# Altium project Central Roll v1.1_Project.PrjPcb
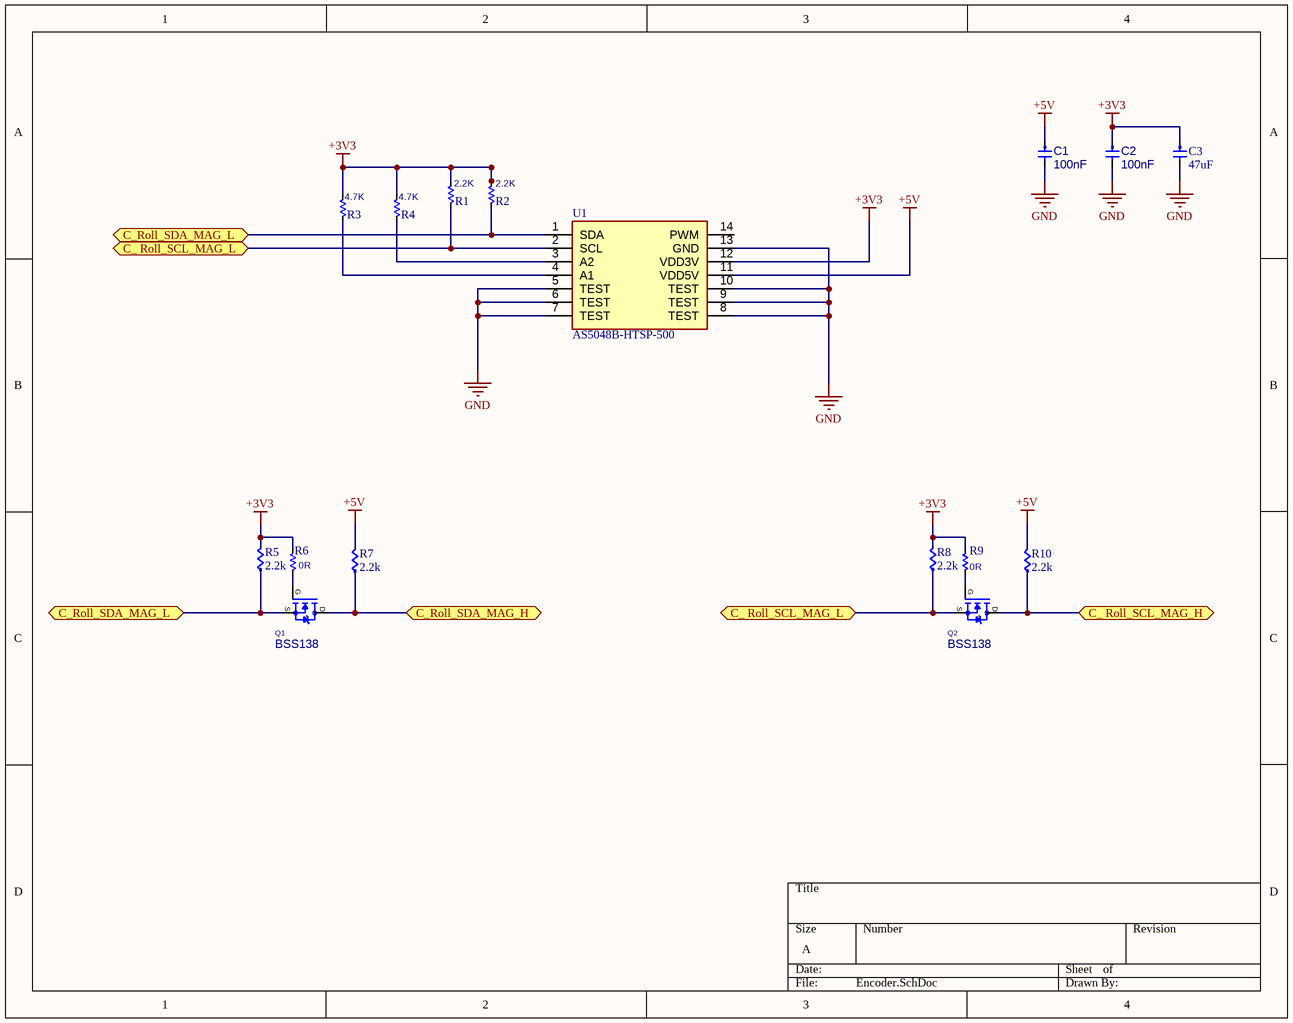
[diagram p0: Encoder.SchDoc]
5 sheets, 69 parts. Net scope: flat (ports and power ports of the same name join across sheets).
Board file: ROLL.PcbDoc
Sheets:
  Encoder.SchDoc
  Driver.SchDoc
  PWR.SchDoc
  Connector.SchDoc
  IMU.SchDoc

## Sheet Encoder.SchDoc
size A; SheetNumber: 1; SheetTotal: 5

### Parts
C1  Capacitance: 100nF  [CAP0603]  (hidden comment: C0603C104M5RACTU)
C2  Capacitance: 100nF  [CAP0603]  (hidden comment: C0603C104M5RACTU)
C3  Capacitance: 47uF  [CAP0805]  (hidden comment: CL21A476MQYNNNE)
Q1  BSS138  [BSS138]
Q2  BSS138  [BSS138]
R1  value 2.2K  [RES0603]  (hidden comment: RES0603)
R2  value 2.2K  [RES0603]  (hidden comment: RES0603)
R3  value 4.7K  [RES0603]  (hidden comment: RES0603)
R4  value 4.7K  [RES0603]  (hidden comment: RES0603)
R5  2.2k  [RES0603]
R6  value 0R  [RES0603]  (hidden comment: RES0603)
R7  2.2k  [RES0603]
R8  2.2k  [RES0603]
R9  value 0R  [RES0603]  (hidden comment: RES0603)
R10  2.2k  [RES0603]
U1  AS5048B-HTSP-500  [AS5048B-HTSP-500]

### Ports
C_ Roll_SCL_MAG_H (bidir), C_ Roll_SCL_MAG_L (bidir), C_Roll_SDA_MAG_H (bidir), C_Roll_SDA_MAG_L (bidir)

### Nets
+3V3: C2.1 C3.1 R1.1 R2.1 R3.1 R4.1 R5.2 R6.2 R8.2 R9.2 U1.12(VDD3V)
+5V: C1.1 R7.2 R10.2 U1.11(VDD5V)
GND: C1.2 C2.2 C3.2 U1.5(TEST) U1.6(TEST) U1.7(TEST) U1.8(TEST) U1.9(TEST) U1.10(TEST) U1.13(GND)
NetP1_49: Q1.3(D) R7.1 ; port C_Roll_SDA_MAG_H
NetP1_51: Q2.3(D) R10.1 ; port C_ Roll_SCL_MAG_H
NetQ1_1: Q1.1(G) R6.1
NetQ1_2: Q1.2(S) R2.2 R5.1 U1.1(SDA) ; port C_Roll_SDA_MAG_L
NetQ2_1: Q2.1(G) R9.1
NetQ2_2: Q2.2(S) R1.2 R8.1 U1.2(SCL) ; port C_ Roll_SCL_MAG_L
NetR3_2: R3.2 U1.4(A1)
NetR4_2: R4.2 U1.3(A2)

Not connected (* = marked no-connect by the designer): U1 14(PWM)

### Library data of the parts
C1 C2 = CMP-00691-1: CAP CER 0.1UF 50V X7R 0603; Manufacturer 1: KEMET; Tolerance: 20%; Dielectric Material: Ceramic; Dissipation Factor: 2.5%; Packaging: Tape and Reel; Mount: Surface Mount,PCB; Min Operating Temperature: -55°C; Case/Package: 0603; Max Operating Temperature: 125°C; Length: 1.6mm; Voltage Rating: 50V; Width: 0.031inch; Voltage Rating (DC): 50V; Dielectric: X7R; Thickness: 0.034inch; Case Code (Imperial): 0603; Case Code (Metric): 1608; Contact Plating: Tin,Matte; Depth: 0.8mm; Height: 0.8mm; Lead Pitch: 0.7mm; Manufacturer Part Number 1: C0603C104M5RACTU; Package Quantity: 1; Radiation Hardening: No; REACH SVHC: No SVHC; Termination: SMD/SMT
C3 = 885012107014: CAP CER 47UF 6.3V X5R 0805; Tolerance: 20%; Manufacturer Part Number: CL21A476MQYNNNE; RoHS: Yes; Category: Ceramic Capacitors; Stock 1: 3580; Pricing 1: 1=0.37000, 5=0.35200, 10=0.33000, 25=0.31900, 50=0.30900, 100=0.29800 (USD); Mount: Surface Mount; Case/Package: 0805; Case Code (Metric): 2012; Case Code (Imperial): 0805; Min Operating Temperature: -55°C; Max Operating Temperature: 85°C; Packaging: Cut Tape; Voltage Rating: 6.3V; Dielectric: X5R; Voltage Rating (DC): 6.3V; Series: WCAP-CSGP; Length: 0.079inch; Width: 0.049inch; Thickness: 0.057inch; RoHS Compliant: Yes; ComponentLink1URL: http://www.farnell.com/datasheets/1958454.pdf?src-supplier=Farnell; ComponentLink1Description: http://www.farnell.com/datasheets/1958454.pdf?src-supplier=Farnell; ComponentLink2URL: http://www.farnell.com/datasheets/1958454.pdf?src-supplier=Element14; ComponentLink2Description: http://www.farnell.com/datasheets/1958454.pdf?src-supplier=Element14; ComponentLink3URL: https://katalog.we-online.de/pbs/datasheet/885012107014.pdf?src-supplier=Digi-Key; ComponentLink3Description: https://katalog.we-online.de/pbs/datasheet/885012107014.pdf?src-supplier=Digi-Key; ComponentLink4URL: http://www.farnell.com/datasheets/1958454.pdf?src-supplier=Newark; ComponentLink4Description: http://www.farnell.com/datasheets/1958454.pdf?src-supplier=Newark; Supplier 1: Newark
Q1 Q2 = BSS138: N-Channel 50 V 220mA (Ta) 350mW (Ta) Surface Mount SOT-23-3; Drain to Source Voltage (Vdss): 50 V; (Max Rds On, Min Rds On: 4.5V, 10V; Rds On (Max) @ Id, Vgs: 3.5Ohm @ 220mA, 10V; Vgs(th) (Max) @ Id: 1.6V @ 1mA; Vgs (Max): ±20V; Input Capacitance (Ciss) (Max) @ Vds: 50 pF @ 25 V; Power Dissipation (Max): 225mW (Ta); MP: BSS138; FET Type: N-Channel; Current - Continuous Drain (Id) @ 25°C: 220mA; Operating Temperature: 150°C (TJ); Supplier Device Package: SOT-23
R1-R4 R6 R9 = RES0603: RES 0805; MP: add later
R5 R7 R8 R10 = RC0603FR-072K2L: Res Thick Film 0603 2.2K Ohm 1% 0.1W(1/10W) +/-100ppm/C Epoxy Pad SMD T/R; Manufacturer: Yageo Group; Max Power Dissipation: 100mW; Resistance: 2.2kΩ; Temperature Coefficient: 100ppm/°C; Voltage Rating: 75V; Voltage Rating (DC): 50V; Supplier 1: Avnet; Manufacturer Part Number: RC0603FR-072K2L; RoHS: Compliant; Category: Chip SMD Resistors; Stock 1: 415000; Pricing 1: 5000=0.00146, 10000=0.00141, 20000=0.00136, 30000=0.00131, 40000=0.00127 (USD); Case/Package: 0603; Case Code (Imperial): 0603; Case Code (Metric): 0603; China RoHS: Non-Compliant; Composition: Thick Film; Depth: 800µm; Features: Moisture Resistant; Height: 450µm; Lead Free: Lead Free; Length: 1.6mm; Lifecycle Status: Production; Max Operating Temperature: 155°C; Military Standard: Not; Min Operating Temperature: -55°C; Mount: Surface Mount; Number of Pins: 2; Number of Terminals: 2; Number of Terminations: 2; Packaging: Tape & Reel; Power Dissipation: 100mW; Power Rating: 100mW; REACH SVHC: Yes; Schedule B: 8533210045, 8533210045|8533210045|8533210045|8533210045|8533210045|8533210045|8533210045|8533210045|8533210045|8533210045|8533210045|8533210045|8533210045|8533210045|8533210045, 8533210045|8533210045|8533210045|8533210045|8533210045|8533210045|8533210045|8533210045|8533210045|8533210045|8533210045|8533210045|8533210045|8533210045|8533210045|8533210045, 8533210045|8533210045|8533210045|8533210045|8533210045|8533210045|8533210045|8533210045|8533210045|8533210045|8533210045|8533210045|8533210045|8533210045|8533210045|8533210045|8533210045; Termination: SMD/SMT; Tolerance: 1%; Width: 800µm; Working Voltage: 75V; ComponentLink1URL: https://datasheet.octopart.com:443/RC0603FR-072K2L-Yageo-datasheet-175887523.pdf?src-supplier=IHS; ComponentLink1Description: https://datasheet.octopart.com:443/RC0603FR-072K2L-Yageo-datasheet-175887523.pdf?src-supplier=IHS; ComponentLink2URL: https://datasheet.octopart.com:443/RC0603FR-072K2L-Yageo-datasheet-103092701.pdf?src-supplier=Upverter; ComponentLink2Description: https://datasheet.octopart.com:443/RC0603FR-072K2L-Yageo-datasheet-103092701.pdf?src-supplier=Upverter; ComponentLink3URL: https://datasheet.octopart.com:443/RC0603FR-072K2L-Yageo-datasheet-8328172.pdf?src-supplier=Newark; ComponentLink3Description: https://datasheet.octopart.com:443/RC0603FR-072K2L-Yageo-datasheet-8328172.pdf?src-supplier=Newark; ComponentLink4URL: https://datasheet.octopart.com:443/RC0603FR-072K2L-Yageo-datasheet-12596169.pdf?src-supplier=Newark; ComponentLink4Description: https://datasheet.octopart.com:443/RC0603FR-072K2L-Yageo-datasheet-12596169.pdf?src-supplier=Newark; ComponentLink5URL: https://datasheet.octopart.com:443/RC0603FR-072K2L-Yageo-datasheet-13691069.pdf?src-supplier=Newark; ComponentLink5Description: https://datasheet.octopart.com:443/RC0603FR-072K2L-Yageo-datasheet-13691069.pdf?src-supplier=Newark; ComponentLink6URL: https://datasheet.octopart.com:443/RC0603FR-072K2L-Yageo-datasheet-34211833.pdf?src-supplier=element14+APAC; ComponentLink6Description: https://datasheet.octopart.com:443/RC0603FR-072K2L-Yageo-datasheet-34211833.pdf?src-supplier=element14+APAC; ComponentLink7URL: https://datasheet.octopart.com:443/RC0603FR-072K2L-Yageo-datasheet-62067350.pdf?src-supplier=element14+APAC; ComponentLink7Description: https://datasheet.octopart.com:443/RC0603FR-072K2L-Yageo-datasheet-62067350.pdf?src-supplier=element14+APAC; ComponentLink8URL: https://datasheet.octopart.com:443/RC0603FR-072K2L-Yageo-datasheet-17842380.pdf?src-supplier=element14+APAC; ComponentLink8Description: https://datasheet.octopart.com:443/RC0603FR-072K2L-Yageo-datasheet-17842380.pdf?src-supplier=element14+APAC; ComponentLink9URL: https://datasheet.octopart.com:443/RC0603FR-072K2L-Yageo-datasheet-21426514.pdf?src-supplier=element14+APAC; ComponentLink9Description: https://datasheet.octopart.com:443/RC0603FR-072K2L-Yageo-datasheet-21426514.pdf?src-supplier=element14+APAC; ComponentLink10URL: https://datasheet.octopart.com:443/RC0603FR-072K2L-Yageo-datasheet-164759695.pdf?src-supplier=Future+Electronics; ComponentLink10Description: https://datasheet.octopart.com:443/RC0603FR-072K2L-Yageo-datasheet-164759695.pdf?src-supplier=Future+Electronics; ComponentLink11URL: https://datasheet.octopart.com:443/RC0603FR-072K2L-Yageo-datasheet-137700087.pdf?src-supplier=Future+Electronics; ComponentLink11Description: https://datasheet.octopart.com:443/RC0603FR-072K2L-Yageo-datasheet-137700087.pdf?src-supplier=Future+Electronics; ComponentLink12URL: https://datasheet.octopart.com:443/RC0603FR-072K2L-Yageo-datasheet-27584510.pdf?src-supplier=Future+Electronics; ComponentLink12Description: https://datasheet.octopart.com:443/RC0603FR-072K2L-Yageo-datasheet-27584510.pdf?src-supplier=Future+Electronics; ComponentLink13URL: https://datasheet.octopart.com:443/RC0603FR-072K2L-Yageo-datasheet-15599030.pdf?src-supplier=Future+Electronics; ComponentLink13Description: https://datasheet.octopart.com:443/RC0603FR-072K2L-Yageo-datasheet-15599030.pdf?src-supplier=Future+Electronics; ComponentLink14URL: https://datasheet.octopart.com:443/RC0603FR-072K2L-Yageo-datasheet-8324193.pdf?src-supplier=Future+Electronics; ComponentLink14Description: https://datasheet.octopart.com:443/RC0603FR-072K2L-Yageo-datasheet-8324193.pdf?src-supplier=Future+Electronics; ComponentLink15URL: https://datasheet.octopart.com:443/RC0603FR-072K2L-Yageo-datasheet-79472498.pdf?src-supplier=Megastar; ComponentLink15Description: https://datasheet.octopart.com:443/RC0603FR-072K2L-Yageo-datasheet-79472498.pdf?src-supplier=Megastar; ComponentLink16URL: https://datasheet.octopart.com/RC0603FR-072K2L-Yageo-datasheet-73766026.pdf; ComponentLink16Description: https://datasheet.octopart.com/RC0603FR-072K2L-Yageo-datasheet-73766026.pdf; ComponentLink17URL: https://datasheet.octopart.com:443/RC0603FR-072K2L-Yageo-datasheet-118562.pdf?src-supplier=DigiKey; ComponentLink17Description: https://datasheet.octopart.com:443/RC0603FR-072K2L-Yageo-datasheet-118562.pdf?src-supplier=DigiKey; ComponentLink18URL: https://datasheet.octopart.com:443/RC0603FR-072K2L-Yageo-datasheet-499455.pdf?src-supplier=element14; ComponentLink18Description: https://datasheet.octopart.com:443/RC0603FR-072K2L-Yageo-datasheet-499455.pdf?src-supplier=element14; ComponentLink19URL: http://sigma.octopart.com:80/rohs_statement/Yageo-company-2.pdf?src-supplier=Compliance+Statements; ComponentLink19Description: http://sigma.octopart.com:80/rohs_statement/Yageo-company-2.pdf?src-supplier=Compliance+Statements; ComponentLink20URL: http://sigma.octopart.com:80/conflict_mineral_statement/Yageo-company-3.pdf?src-supplier=Compliance+Statements; ComponentLink20Description: http://sigma.octopart.com:80/conflict_mineral_statement/Yageo-company-3.pdf?src-supplier=Compliance+Statements; Supplier Part Number 1: RC0603FR-072K2L
U1 = AS5048B-HTSP-500: Hall Effect Sensor Angle External Magnet, Not Included Gull Wing; Rotation Angle - Electrical, Mechanical: 0° ~ 360°, Continuous; Output: I2C, PWM; Voltage - Supply: 3V ~ 3.6V, 4.5V ~ 5.5V; MP: AS5048B-HTSP-500; Technology: Hall Effect; Actuator Type: External Magnet, Not Included; Mounting TypeOperating Temperature: -40°C ~ 150°C; Package / Case: 14-TSSOP

## Sheet Driver.SchDoc
size A; SheetNumber: 2; SheetTotal: 5
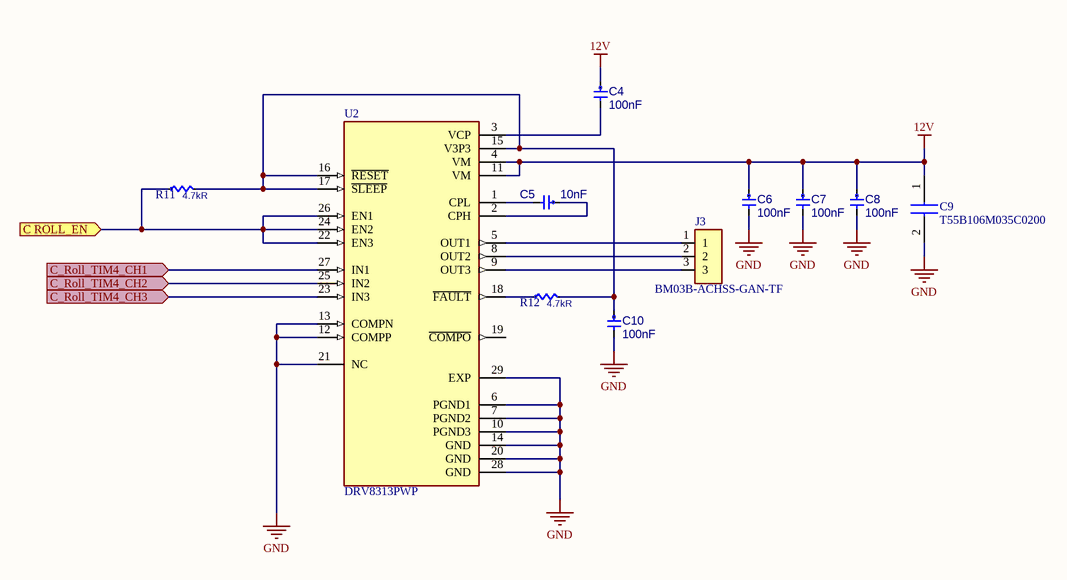
[diagram p1: Driver.SchDoc]

### Parts
C4  Capacitance: 100nF  [CAP0603]  (hidden comment: C0603C104M5RACTU)
C5  Capacitance: 10nF  [CAP0603]  (hidden comment: C0603C103M5RACTU)
C6  Capacitance: 100nF  [CAP0603]  (hidden comment: C0603C104M5RACTU)
C7  Capacitance: 100nF  [CAP0603]  (hidden comment: C0603C104M5RACTU)
C8  Capacitance: 100nF  [CAP0603]  (hidden comment: C0603C104M5RACTU)
C9  T55B106M035C0200  [T55B106M035C0200]
C10  Capacitance: 100nF  [CAP0603]  (hidden comment: C0603C104M5RACTU)
J3  BM03B-ACHSS-GAN-TF  [BM03B-ACHSS-GAN-TF]
R11  Resistance: 4.7kR  [RES0603]  (hidden comment: RC0603JR-074K7L)
R12  Resistance: 4.7kR  [RES0603]  (hidden comment: RC0603JR-074K7L)
U2  DRV8313PWP  [DRV8313PWP]

### Ports
C ROLL_EN (in), C_Roll_TIM4_CH1 (in), C_Roll_TIM4_CH2 (in), C_Roll_TIM4_CH3 (in)

### Nets
12V: C4.1 C6.1 C7.1 C8.1 C9.1 U2.4(VM) U2.11(VM)
GND: C6.2 C7.2 C8.2 C9.2 C10.2 U2.6(PGND1) U2.7(PGND2) U2.10(PGND3) U2.12(COMPP) U2.13(COMPN) U2.14(GND) U2.20(GND) U2.21(NC) U2.28(GND) U2.29(EXP)
NetC4_2: C4.2 U2.3(VCP)
NetC5_1: C5.1 U2.2(CPH)
NetC5_2: C5.2 U2.1(CPL)
NetC10_1: C10.1 R11.2 R12.2 U2.15(V3P3) U2.16(~{RESET}) U2.17(~{SLEEP})
NetJ3_1: J3.1 U2.5(OUT1)
NetJ3_2: J3.2 U2.8(OUT2)
NetJ3_3: J3.3 U2.9(OUT3)
NetP1_20: R11.1 U2.22(EN3) U2.24(EN2) U2.26(EN1) ; port C ROLL_EN
NetP1_24: U2.27(IN1) ; port C_Roll_TIM4_CH1
NetP1_26: U2.25(IN2) ; port C_Roll_TIM4_CH2
NetP1_28: U2.23(IN3) ; port C_Roll_TIM4_CH3
NetR12_1: R12.1 U2.18(~{FAULT})

Not connected (* = marked no-connect by the designer): U2 19(~{COMPO})

### Library data of the parts
C4 C6-C8 C10 = CMP-00691-1: as C1 on sheet Encoder; Packaging: Tape and Reel; Mount: Surface Mount,PCB; Min Operating Temperature: -55°C; Case/Package: 0603; Max Operating Temperature: 125°C; Length: 1.6mm; Voltage Rating: 50V; Width: 0.031inch; Voltage Rating (DC): 50V; Dielectric: X7R; Thickness: 0.034inch; Case Code (Imperial): 0603; Case Code (Metric): 1608; Contact Plating: Tin,Matte; Depth: 0.8mm; Height: 0.8mm; Lead Pitch: 0.7mm; Manufacturer Part Number 1: C0603C104M5RACTU; Package Quantity: 1; Radiation Hardening: No; REACH SVHC: No SVHC; Termination: SMD/SMT
C5 = CMP-00691-1: CAP CER 10NF 50V X7R 0603; Manufacturer 1: KEMET; Tolerance: 20%; Dielectric Material: Ceramic; Dissipation Factor: 2.5%; Packaging: Tape and Reel; Mount: Surface Mount,PCB; Min Operating Temperature: -55°C; Case/Package: 0603; Max Operating Temperature: 125°C; Length: 1.6mm; Voltage Rating: 50V; Width: 0.031inch; Voltage Rating (DC): 50V; Dielectric: X7R; Thickness: 0.034inch; Case Code (Imperial): 0603; Case Code (Metric): 1608; Contact Plating: Tin,Matte; Depth: 0.8mm; Height: 0.8mm; Lead Pitch: 0.7mm; Manufacturer Part Number 1: C0603C103M5RACTU; Package Quantity: 1; Radiation Hardening: No; REACH SVHC: No SVHC; Termination: SMD/SMT
C9 = T55B106M035C0200: Capacitor; Manufacturer_Name: Vishay; Datasheet Link: https://www.mouser.cn/datasheet/2/427/t55-537218.pdf; Height: 2.1mm; Manufacturer_Part_Number: T55B106M035C0200; Mouser Part Number: 74-T55B106M035C0200; Mouser Price/Stock: https://www.mouser.co.uk/ProductDetail/Vishay-Polytech/T55B106M035C0200?qs=BZBei1rCqCCB8UyqeipbyQ%3D%3D; Arrow Part Number: T55B106M035C0200; Arrow Price/Stock: https://www.arrow.com/en/products/t55b106m035c0200/vishay
J3 = BM03B-ACHSS-GAN-TF: ACH Series 3 Position 1.2 mm Pitch Disconnectable Crimp Style Housing; Package: None; Price: None; Value: *; MP: BM03B-ACHSS-GAN-TF; Availability: Unavailable
R11 R12 = CMP-01404-1: RES SMD 4.7K OHM 5% 1/10W 0603; Manufacturer 1: Yageo; Voltage Rating (DC): 50V; Temperature Coefficient: 100ppm/°C; Max Power Dissipation: 100mW; Number of Terminations: 2; Width: 0.8mm; Min Operating Temperature: -55°C; Case/Package: 0603; Military Standard: Not; Termination: SMD/SMT; Manufacturer Part Number 1: RC0603JR-074K7L; Construction: Rectangular; Features: Moisture Resistant; Length: 1.6mm; Resistance Tolerance: 5%; Lead Free: Lead Free; REACH SVHC: No SVHC; Voltage Rating: 50V; Case Code (Metric): 1608; Case Code (Imperial): 0603; Packaging: Tape and Reel; Max Operating Temperature: 155°C; Size Code: 0603; Resistor Type: Thick Film; Tolerance: 5%; Number of Pins: 2; Depth: 0.8mm; Power Rating: 100mW; Series: RC
U2 = DRV8313PWP: 65-V max, 3-A peak 3-phase motor driver; MF: Texas Instruments; Package: HTSSOP-28 Texas Instruments; Price: None; Check_prices: https://www.snapeda.com/parts/DRV8313PWP/Texas+Instruments/view-part/?ref=eda; Value: *; SnapEDA_Link: https://www.snapeda.com/parts/DRV8313PWP/Texas+Instruments/view-part/?ref=snap; MP: DRV8313PWP; Availability: In Stock; Purchase-URL: https://pricing.snapeda.com/search?q=DRV8313PWP&ref=eda

## Sheet PWR.SchDoc
size A; SheetNumber: 3; SheetTotal: 5
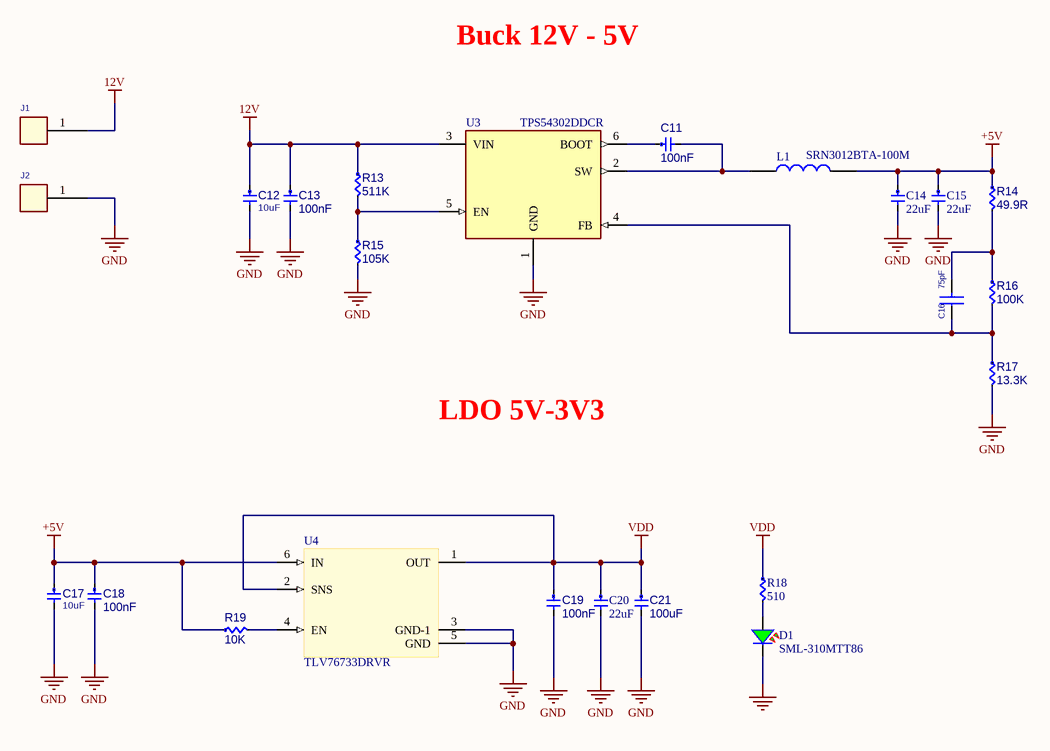
[diagram p2: PWR.SchDoc]

### Parts
C11  Capacitance: 100nF  [CAP0402]  (hidden comment: CC0402KRX5R9BB104)
C12  Capacitance: 10uF  [CAP0603]  (hidden comment: GRM188R6YA106MA73D)
C13  Capacitance: 100nF  [CAP0402]  (hidden comment: CC0402KRX5R9BB104)
C14  Capacitance: 22uF  [CAP0402]  (hidden comment: GRM158R61A226ME15D)
C15  Capacitance: 22uF  [CAP0402]  (hidden comment: GRM158R61A226ME15D)
C16  75pF  [CAP0402]
C17  Capacitance: 10uF  [CAP0603]  (hidden comment: GRM188R6YA106MA73D)
C18  Capacitance: 100nF  [CAP0402]  (hidden comment: CC0402KRX5R9BB104)
C19  Capacitance: 100nF  [CAP0402]  (hidden comment: CC0402KRX5R9BB104)
C20  Capacitance: 22uF  [CAP0402]  (hidden comment: GRM158R61A226ME15D)
C21  Capacitance: 100uF  [CAP0805]  (hidden comment: CL21A107MQYNNWE)
D1  SML-310MTT86  [LED0603 RED]
J1  CON1  [ESC PAD 3X4]  (value not drawn)
J2  CON1  [ESC PAD 3X4]  (value not drawn)
L1  SRN3012BTA-100M  [SRN3012BTA-100M]
R13  511K  [RES0402]
R14  49.9R  [RES0402]
R15  105K  [RES0402]
R16  100K  [RES0402]
R17  13.3K  [RES0402]
R18  Resistance: 510  [RES0402]  (hidden comment: RT0402FRE07510RL)
R19  Resistance: 10K  [RES0402]  (hidden comment: CRCW040210K0JNED)
U3  TPS54302DDCR  [SOT95P280X110-6N - duplicate]
U4  TLV76733DRVR  [SON65P200X200X80-7N - duplicate]

### Nets
12V: C12.1 C13.1 J1.1 R13.1 U3.3(VIN)
+5V: C14.1 C15.1 C17.1 C18.1 L1.2 R14.1 R19.1 U4.6(IN)
GND: C12.2 C13.2 C14.2 C15.2 C17.2 C18.2 C19.2 C20.2 C21.2 D1.1 J2.1 R15.2 R17.2 U3.1(GND) U4.3(GND-1) U4.5(GND)
VDD: C19.1 C20.1 C21.1 R18.1 U4.1(OUT) U4.2(SNS)
NetC11_1: C11.1 U3.6(BOOT)
NetC11_2: C11.2 L1.1 U3.2(SW)
NetC16_1: C16.1 R16.2 R17.1 U3.4(FB)
NetC16_2: C16.2 R14.2 R16.1
NetD1_2: D1.2 R18.2
NetR13_2: R13.2 R15.1 U3.5(EN)
NetR19_2: R19.2 U4.4(EN)

### Notes on the sheet
- Buck 12V - 5V
- LDO 5V-3V3

### Library data of the parts
C11 C13 C18 C19 = CMP-00265-1: CAP CER 0.1UF 50V X5R 0402; Manufacturer: Yageo; Tolerance: 10%; Voltage Rating: 50V; Dielectric: X5R; Width: 0.02inch; Thickness: 0.022inch; Packaging: Tape and Reel; Length: 0.039inch; Mount: Surface Mount; Case/Package: 0402; Min Operating Temperature: -55°C; Halogen Free: Halogen Free; Voltage Rating (DC): 50V; Manufacturer Part Number: CC0402KRX5R9BB104; Max Operating Temperature: 85°C; Lead Free: Lead Free; Manufacturer 1: Yageo; Manufacturer Part Number 1: CC0402KRX5R9BB104
C12 C17 = CMP-01031-1: CAP CER 10UF 35V X5R 0603; Manufacturer 1: Murata Electronics; Tolerance: 20%; Case/Package: 0603; Depth: 0.8mm; Composition: Ceramic; Length: 1.6mm; Max Operating Temperature: 85°C; Lead Free: Lead Free; Thickness: 0.031inch; Number of Pins: 2; Weight: 0.000222oz; Min Operating Temperature: -55°C; REACH SVHC: No SVHC; Case Code (Metric): 1608; Termination: SMD/SMT; Packaging: Tape and Reel; Height: 0.8mm; Voltage Rating (DC): 35V; Width: 0.031inch; Voltage Rating: 35V; Manufacturer Part Number 1: GRM188R6YA106MA73D; Mount: Surface Mount; Package Quantity: 1; Case Code (Imperial): 0603; Dielectric: X5R; Voltage: 35V
C14 C15 C20 = CMP-00520-1: CAP CER 22UF 10V X5R 0402; Manufacturer 1: TDK Corporation; Tolerance: 10%; Case Code (Imperial): 0402; Case/Package: 0402; Voltage: 10V; Min Operating Temperature: -55°C; Termination: SMD/SMT; Voltage Rating: 10V; Length: 1mm; REACH SVHC: No SVHC; Max Operating Temperature: 85°C; Radiation Hardening: No; Depth: 0.5mm; Case Code (Metric): 1005; Dielectric: X5R; Manufacturer Part Number 1: GRM158R61A226ME15D; Packaging: Tape and Reel
C16 = CAP_Dup1_16: CAP CER 75PF 25V C0G/NP0 0402; Manufacturer PN: CC0402JRNPO9BN750; Manufacturer: YAGEO; PART_NUMBER: TMP-416; CLASS: DISCRETE; Tolerance: 5%; Temperature Coefficient: C0G, NP0; Dielectric Type: Capacitors; Rated Voltage: 25V; Package Size: 0402 (1005 Metric)
C21 = CMP-00446-1: CAP CER 100UF 6.3V X5R 0805; Manufacturer 1: TDK Corporation; Tolerance: 20%; Dielectric Material: Ceramic; Length: 2mm; Dielectric: X5R; Height: 1.25mm; Width: 0.049inch; Depth: 1.25mm; Voltage Rating (DC): 6.3V; Manufacturer Part Number 1: CL21A107MQYNNWE; REACH SVHC: No SVHC; Weight: 0.000194oz; Package Quantity: 2000; Mount: Surface Mount; Packaging: Tape and Reel; Case Code (Imperial): 0805; Thickness: 0.057inch; Max Operating Temperature: 85°C; Case/Package: 0805; Case Code (Metric): 2012; Voltage Rating: 6.3V; Termination: SMD/SMT; Composition: Ceramic; Lead Free: Lead Free; Min Operating Temperature: -55°C
D1 = CMP-01130-2: LED GREEN CLEAR 0603 SMD; Manufacturer 1: Rohm Semiconductor; Luminous Intensity: 16mcd; Wavelength: 570nm; Number of LEDs: 1; Color: Green,Yellow; Forward Voltage: 2.2V; Lens Color: Colorless,Clear; Forward Current: 20mA; Viewing Angle: 140°; Lens Style: Rectangular,Clear,Diffused,Colorless; Case Code (Imperial): 0603; Lens Transparency: Clear; Package Quantity: 3000; Width: 0.8mm; Manufacturer Part Number 1: SML-310MTT86; Min Operating Temperature: -30°C; Length: 1.6mm; Packaging: Tape and Reel; Dominant Wavelength: 570nm; Height: 0.9mm; Radiation Hardening: No; Test Current: 20mA; Case Code (Metric): 1608; Lead Free: Lead Free; Case/Package: 0603; Mount: Surface Mount; Max Operating Temperature: 85°C; Illumination Color: Green; Number of Pins: 2
J1 J2 = CON1: SOLDER PADS
L1 = SRN3012BTA-330M: 10uH; Manufacturer_Name: Bourns; Geometry.Height: 1.2mm; Mouser Part Number: SRN3012BTA-100M; Mouser Price/Stock: https://www.mouser.co.uk/ProductDetail/Bourns/SRN3012BTA-330M?qs=Imq1NPwxi74rPoSZ4PPaRw%3D%3D; Manufacturer_Part_Number: SRN3012BTA-100M; Datasheet Link: https://www.bourns.com/docs/Product-Datasheets/SRN3012BTA.pdf
R13 = CMP-00299-1_1: RES SMD 511K OHM 1% 1/16W 0402; Manufacturer: Yageo; Manufacturer Part Number: RC0402FR-07511KL; Temperature Coefficient: 100ppm/°C; Working Voltage: 50V; Max Power Dissipation: 63mW; Power Rating: 62.5mW; Height: 0.016inch; Package Quantity: 1; Min Operating Temperature: -55°C; Tolerance: 1%; Military Standard: Not; Packaging: Tape and Reel; Number of Terminations: 2; Width: 0.02inch; Case/Package: 0402; Length: 1mm; Voltage Rating (DC): 50V; Case Code (Metric): 1005; Resistance: 511K; Composition: Thick Film; Voltage Rating: 50V; Max Operating Temperature: 155°C; Case Code (Imperial): 0402; Lead Free: Lead Free; Termination: SMD/SMT; Features: Moisture Resistant; Depth: 0.5mm; Manufacturer 1: Yageo; Manufacturer Part Number 1: RC0402FR-07511KL
R14 = CMP-00299-1_1: RES SMD 49.9R OHM 1% 1/16W 0402; Manufacturer: Yageo; Manufacturer Part Number: RC0402FR-0749R9L; Temperature Coefficient: 100ppm/°C; Working Voltage: 50V; Max Power Dissipation: 63mW; Power Rating: 62.5mW; Height: 0.016inch; Package Quantity: 1; Min Operating Temperature: -55°C; Tolerance: 1%; Military Standard: Not; Packaging: Tape and Reel; Number of Terminations: 2; Width: 0.02inch; Case/Package: 0402; Length: 1mm; Voltage Rating (DC): 50V; Case Code (Metric): 1005; Resistance: 49.9R; Composition: Thick Film; Voltage Rating: 50V; Max Operating Temperature: 155°C; Case Code (Imperial): 0402; Lead Free: Lead Free; Termination: SMD/SMT; Features: Moisture Resistant; Depth: 0.5mm; Manufacturer 1: Yageo; Manufacturer Part Number 1: RC0402FR-0749R9L
R15 = CMP-00299-1_1: RES SMD 105K OHM 1% 1/16W 0402; Manufacturer: Yageo; Manufacturer Part Number: RC0402FR-07105KL; Temperature Coefficient: 100ppm/°C; Working Voltage: 50V; Max Power Dissipation: 63mW; Power Rating: 62.5mW; Height: 0.016inch; Package Quantity: 1; Min Operating Temperature: -55°C; Tolerance: 1%; Military Standard: Not; Packaging: Tape and Reel; Number of Terminations: 2; Width: 0.02inch; Case/Package: 0402; Length: 1mm; Voltage Rating (DC): 50V; Case Code (Metric): 1005; Resistance: 105K; Composition: Thick Film; Voltage Rating: 50V; Max Operating Temperature: 155°C; Case Code (Imperial): 0402; Lead Free: Lead Free; Termination: SMD/SMT; Features: Moisture Resistant; Depth: 0.5mm; Manufacturer 1: Yageo; Manufacturer Part Number 1: RC0402FR-07105KL
R16 = CMP-00299-1_1: RES SMD 100K OHM 1% 1/16W 0402; Manufacturer: Yageo; Manufacturer Part Number: RC0402FR-07100KL; Temperature Coefficient: 100ppm/°C; Working Voltage: 50V; Max Power Dissipation: 63mW; Power Rating: 62.5mW; Height: 0.016inch; Package Quantity: 1; Min Operating Temperature: -55°C; Tolerance: 1%; Military Standard: Not; Packaging: Tape and Reel; Number of Terminations: 2; Width: 0.02inch; Case/Package: 0402; Length: 1mm; Voltage Rating (DC): 50V; Case Code (Metric): 1005; Resistance: 100K; Composition: Thick Film; Voltage Rating: 50V; Max Operating Temperature: 155°C; Case Code (Imperial): 0402; Lead Free: Lead Free; Termination: SMD/SMT; Features: Moisture Resistant; Depth: 0.5mm; Manufacturer 1: Yageo; Manufacturer Part Number 1: RC0402FR-07100KL
R17 = CMP-00299-1_1: RES SMD 13.3K OHM 1% 1/16W 0402; Manufacturer: Yageo; Manufacturer Part Number: RC0402FR-0713K3L; Temperature Coefficient: 100ppm/°C; Working Voltage: 50V; Max Power Dissipation: 63mW; Power Rating: 62.5mW; Height: 0.016inch; Package Quantity: 1; Min Operating Temperature: -55°C; Tolerance: 1%; Military Standard: Not; Packaging: Tape and Reel; Number of Terminations: 2; Width: 0.02inch; Case/Package: 0402; Length: 1mm; Voltage Rating (DC): 50V; Case Code (Metric): 1005; Resistance: 13.3K; Composition: Thick Film; Voltage Rating: 50V; Max Operating Temperature: 155°C; Case Code (Imperial): 0402; Lead Free: Lead Free; Termination: SMD/SMT; Features: Moisture Resistant; Depth: 0.5mm; Manufacturer 1: Yageo; Manufacturer Part Number 1: RC0402FR-0713K3L
R18 = RC0402FR-0722KL: RES SMD 510 OHM 1% 1/16W 0402; Manufacturer: Yageo; Power Rating: 62.5mW; Temperature Coefficient: 100ppm/°C; Voltage Rating: 50V; Max Power Dissipation: 63mW; Supplier 1: Future Electronics; Manufacturer Part Number: RT0402FRE07510RL; RoHS: Yes; Category: Chip SMD Resistors; Stock 1: 1010000; Pricing 1: 10000=0.00100, 50000=0.00090, 300000=0.00080, 1000000=0.00080, 3000000=0.00070 (USD); Case/Package: 0402; Case Code (Metric): 1005; Case Code (Imperial): 0402; Min Operating Temperature: -55°C; Max Operating Temperature: 155°C; Tolerance: 1%; Packaging: Tape and Reel; Package Quantity: 1; Resistor Type: Thick Film; Number of Terminations: 2; Termination: SMD/SMT; Working Voltage: 50V; Features: Moisture Resistant; Series: RC; Resistance Tolerance: 1%; Construction: Rectangular; Length: 0.039inch; Width: 0.02inch; Height: 0.016inch; Depth: 0.5mm; Reach SVHC Compliant: Yes; Lead Free: Lead Free; Military Standard: Not; RoHS Compliant: Yes
R19 = CMP-00034-1: RES SMD 10K OHM 5% 1/16W 0402; Manufacturer: Vishay Dale; Voltage Rating: 50V; Power Rating: 63mW; Temperature Coefficient: 200ppm/°C; Max Operating Temperature: 155°C; Width: 0.5mm; Composition: Thick Film; Length: 1mm; Case Code (Imperial): 0402; Case/Package: 0402; Number of Terminations: 2; Mount: Surface Mount; Depth: 0.5mm; Weight: 2.3E-05oz; Radiation Hardening: No; Package Quantity: 1; Case Code (Metric): 1005; REACH SVHC: Unknown; Tolerance: 5%; Features: Automotive AEC-Q200; Max Power Dissipation: 63mW; Height: 0.016inch; Packaging: Tape and Reel; Military Standard: Not; Min Operating Temperature: -55°C; Manufacturer Part Number 1: CRCW040210K0JNED; Contact Plating: Tin; Termination: SMD/SMT
U3 = TPS54302DDCR: 4.5-V to 28-V Input, 3-A Output, EMI Friendly Synchronous Step-Down Converter; MF: Texas Instruments; Package: SOT-23-THN-6 Texas Instruments; Price: None; Check_prices: https://www.snapeda.com/parts/TPS54302DDCR/Texas+Instruments/view-part/?ref=eda; Value: *; SnapEDA_Link: https://www.snapeda.com/parts/TPS54302DDCR/Texas+Instruments/view-part/?ref=snap; MP: TPS54302DDCR; Availability: In Stock; Purchase-URL: https://pricing.snapeda.com/search?q=TPS54302DDCR&ref=eda
U4 = TLV76733DRVR: Adjustable- and fixed-output, 1-A, 16-V, positive-voltage low-dropout (LDO) linear regulator; MF: Texas Instruments; SnapEDA_Link: https://www.snapeda.com/parts/TLV76733DRVR/Texas+Instruments/view-part/?ref=snap; Package: WSON-6 Texas Instruments; Value: *; MP: TLV76733DRVR; Check_prices: https://www.snapeda.com/parts/TLV76733DRVR/Texas+Instruments/view-part/?ref=eda

## Sheet Connector.SchDoc
size A2; SheetNumber: 4; SheetTotal: 5
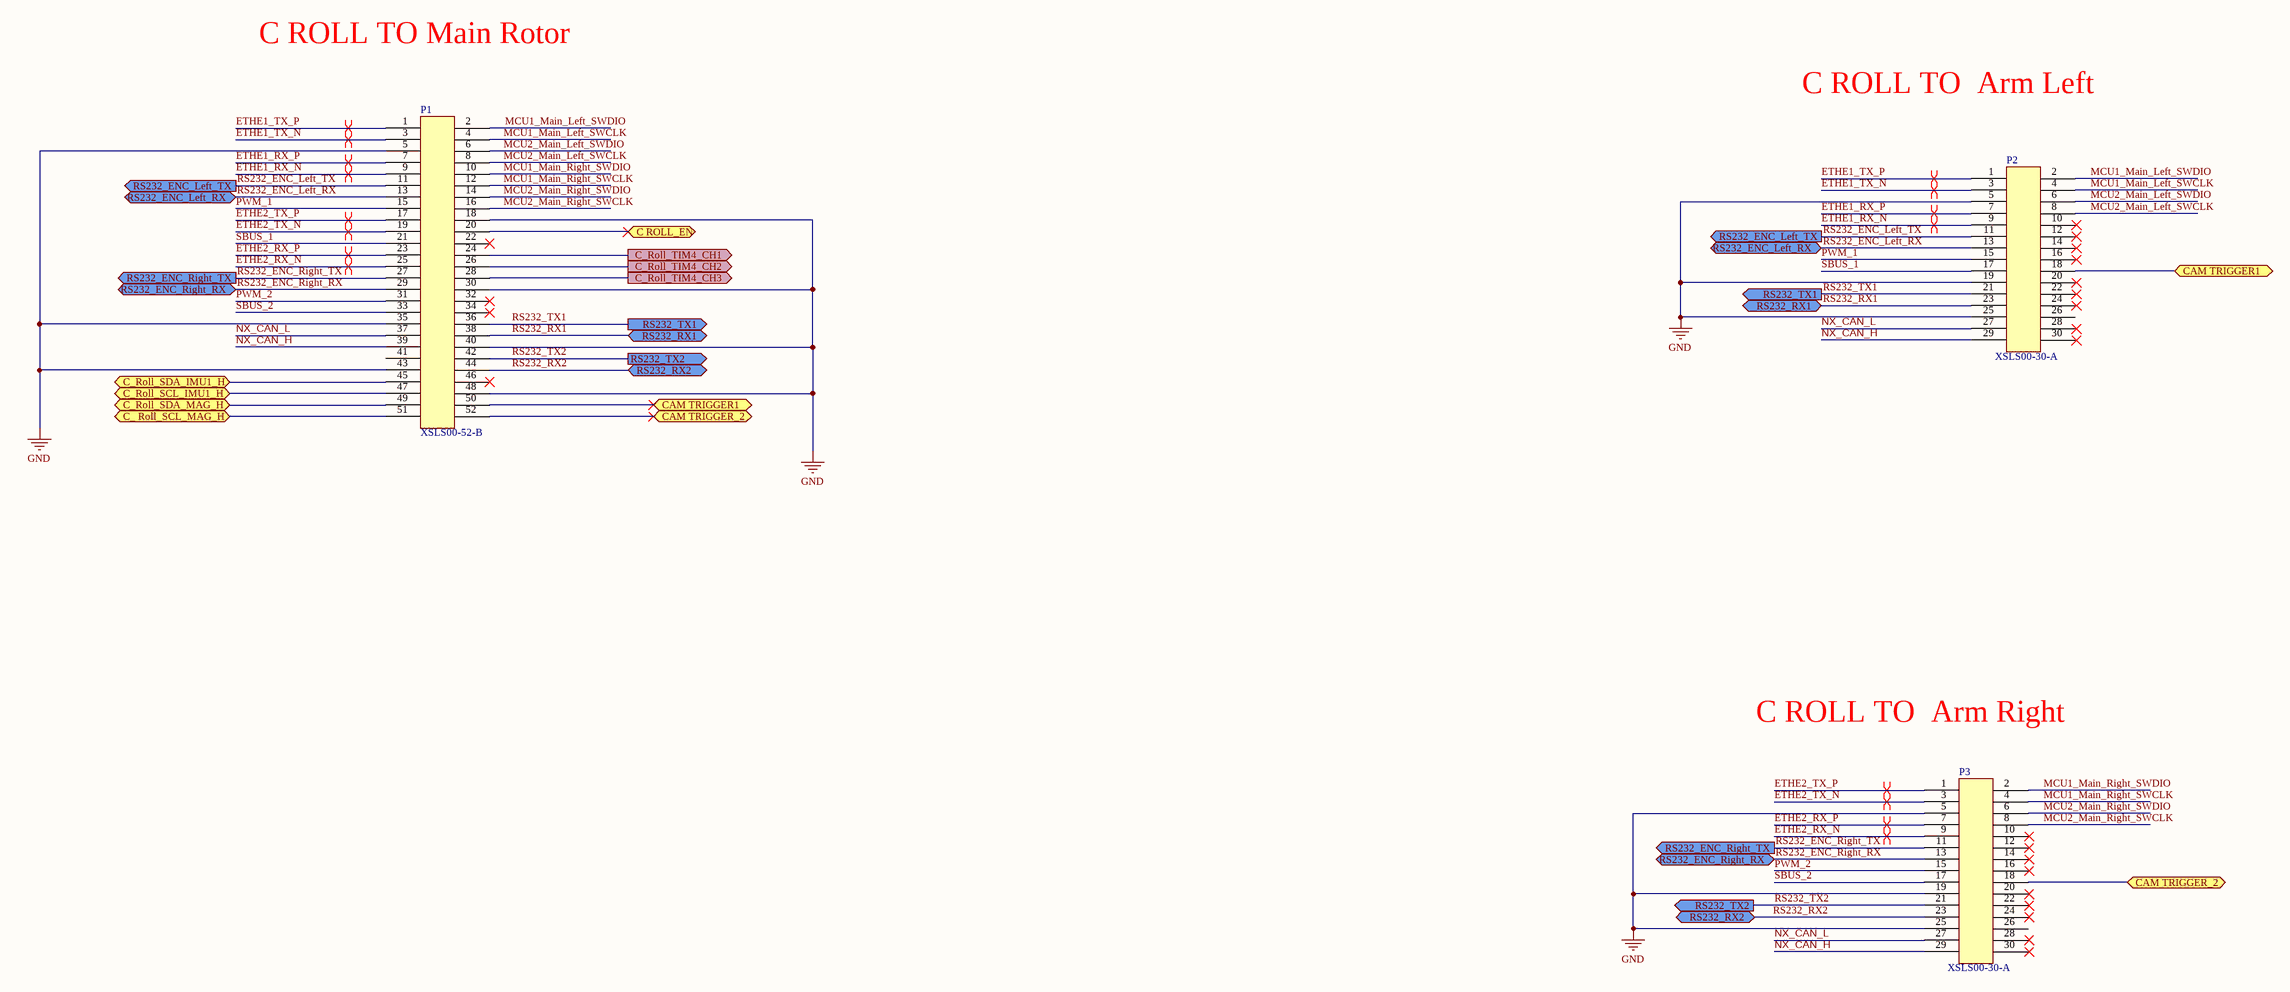
[diagram p3: Connector.SchDoc]

### Parts
P1  XSLS00-52-B  [XSXL52]
P2  XSLS00-30-A  [XSXL30]
P3  XSLS00-30-A  [XSXL30]

### Ports
C ROLL_EN (bidir), C_ Roll_SCL_MAG_H (bidir), C_Roll_SCL_IMU1_H (bidir), C_Roll_SDA_IMU1_H (bidir), C_Roll_SDA_MAG_H (bidir), C_Roll_TIM4_CH1 (out), C_Roll_TIM4_CH2 (out), C_Roll_TIM4_CH3 (out), CAM TRIGGER1 (bidir), CAM TRIGGER_2 (bidir), RS232_ENC_Left_RX (bidir), RS232_ENC_Left_TX (out), RS232_ENC_Right_RX (bidir), RS232_ENC_Right_TX (out), RS232_RX1 (bidir), RS232_RX2 (bidir), RS232_TX1 (out), RS232_TX2 (out)

### Nets
GND: P1.5 P1.18 P1.30 P1.35 P1.40 P1.43 P1.48 P2.5 P2.19 P2.25 P3.5 P3.19 P3.25
ETHE1_RX_N: P1.9 P2.9
ETHE1_RX_P: P1.7 P2.7
ETHE1_TX_N: P1.3 P2.3
ETHE1_TX_P: P1.1 P2.1
ETHE2_RX_N: P1.25 P3.9
ETHE2_RX_P: P1.23 P3.7
ETHE2_TX_N: P1.19 P3.3
ETHE2_TX_P: P1.17 P3.1
MCU1_Main_Left_SWCLK: P1.4 P2.4
MCU1_Main_Left_SWDIO: P1.2 P2.2
MCU1_Main_Right_SWCLK: P1.12 P3.4
MCU1_Main_Right_SWDIO: P1.10 P3.2
MCU2_Main_Left_SWCLK: P1.8 P2.8
MCU2_Main_Left_SWDIO: P1.6 P2.6
MCU2_Main_Right_SWCLK: P1.16 P3.8
MCU2_Main_Right_SWDIO: P1.14 P3.6
NX_CAN_H: P1.39 P2.29 P3.29
NX_CAN_L: P1.37 P2.27 P3.27
PWM_1: P1.15 P2.15
PWM_2: P1.31 P3.15
RS232_ENC_Left_RX: P1.13 P2.13 ; port RS232_ENC_Left_RX
RS232_ENC_Left_TX: P1.11 P2.11 ; port RS232_ENC_Left_TX
RS232_ENC_Right_RX: P1.29 P3.13 ; port RS232_ENC_Right_RX
RS232_ENC_Right_TX: P1.27 P3.11 ; port RS232_ENC_Right_TX
RS232_RX1: P1.38 P2.23 ; port RS232_RX1
RS232_RX2: P1.44 P3.23 ; port RS232_RX2
RS232_TX1: P1.36 P2.21 ; port RS232_TX1
RS232_TX2: P1.42 P3.21 ; port RS232_TX2
SBUS_1: P1.21 P2.17
SBUS_2: P1.33 P3.17
NetP1_20: P1.20 ; port C ROLL_EN
NetP1_24: P1.24 ; port C_Roll_TIM4_CH1
NetP1_26: P1.26 ; port C_Roll_TIM4_CH2
NetP1_28: P1.28 ; port C_Roll_TIM4_CH3
NetP1_45: P1.45 ; port C_Roll_SDA_IMU1_H
NetP1_47: P1.47 ; port C_Roll_SCL_IMU1_H
NetP1_49: P1.49 ; port C_Roll_SDA_MAG_H
NetP1_50: P1.50 P2.18 ; port CAM TRIGGER1
NetP1_51: P1.51 ; port C_ Roll_SCL_MAG_H
NetP1_52: P1.52 P3.18 ; port CAM TRIGGER_2

Not connected (* = marked no-connect by the designer): P1 22* 32* 34* 41 46*; P2 10 12 14 16 20 22 24 26 28 30; P3 10 12 14 16 20 22 24 26 28 30

### Layout directives
differential pair: ETHE1_RX_N, ETHE1_RX_P, ETHE1_TX_N, ETHE1_TX_P, ETHE2_RX_N, ETHE2_RX_P, ETHE2_TX_N, ETHE2_TX_P

### Notes on the sheet
- C ROLL TO Main Rotor
- C ROLL TO  Arm Left
- C ROLL TO  Arm Right

## Sheet IMU.SchDoc
size A; SheetNumber: 5; SheetTotal: 5
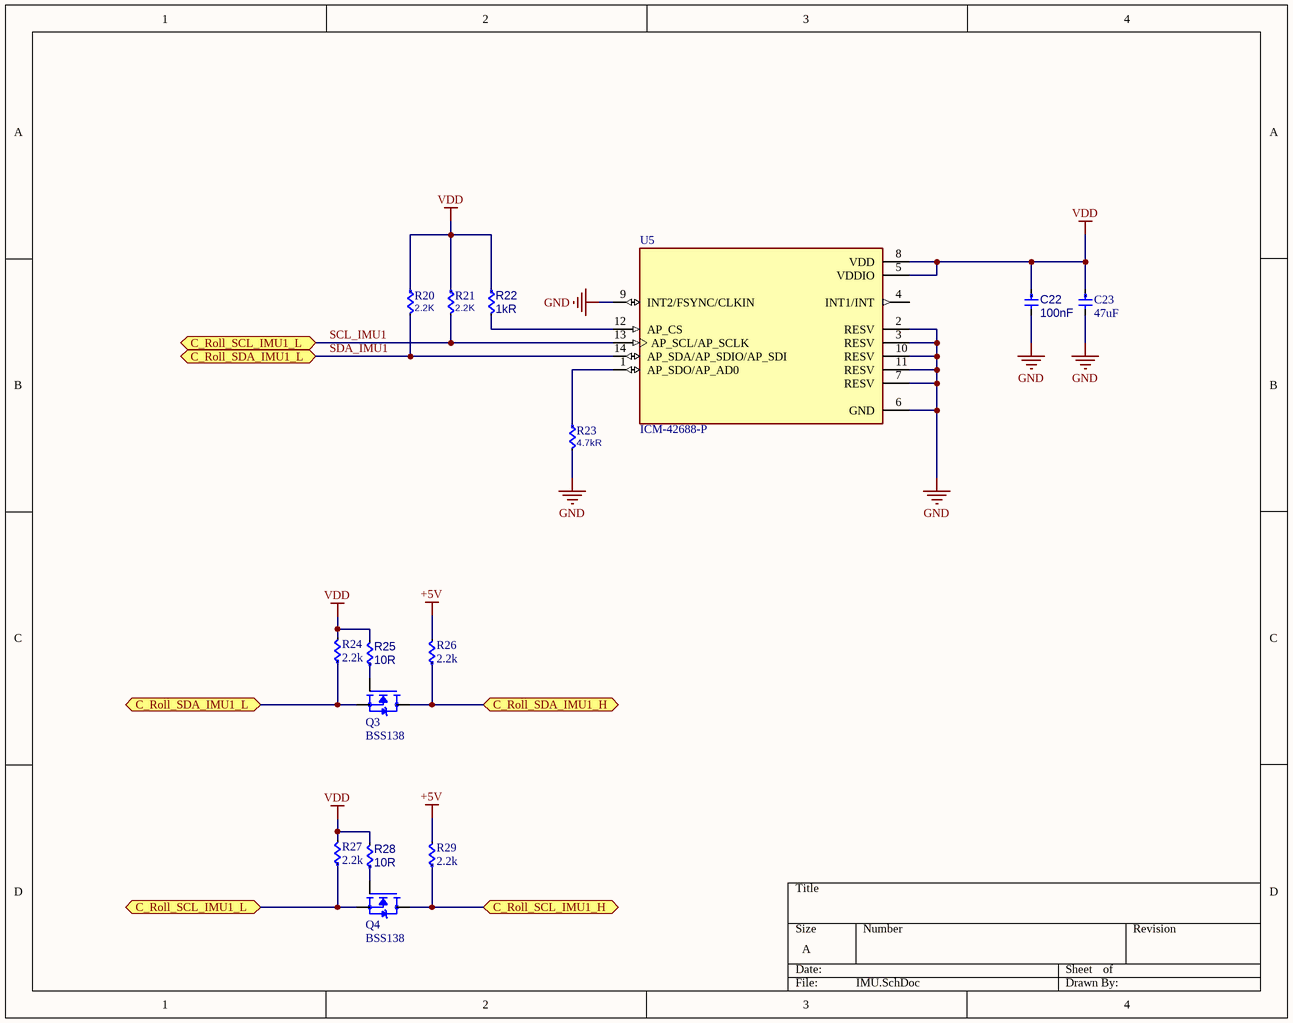
[diagram p4: IMU.SchDoc]

### Parts
C22  Capacitance: 100nF  [CAP0603]  (hidden comment: C0603C104M5RACTU)
C23  Capacitance: 47uF  [CAP0805]  (hidden comment: CL21A476MQYNNNE)
Q3  BSS138  [BSS138]
Q4  BSS138  [BSS138]
R20  Resistance: 2.2K  [RES0603]  (hidden comment: RC0603FR-072K2L)
R21  Resistance: 2.2K  [RES0603]  (hidden comment: RC0603FR-072K2L)
R22  Resistance: 1kR  [RES0603]  (hidden comment: RC0603FR-071KL)
R23  Resistance: 4.7kR  [RES0603]  (hidden comment: RC0603JR-074K7L)
R24  2.2k  [RES0603]
R25  Resistance: 10R  [RES0603]  (hidden comment: MCR03EZPJ100)
R26  2.2k  [RES0603]
R27  2.2k  [RES0603]
R28  Resistance: 10R  [RES0603]  (hidden comment: MCR03EZPJ100)
R29  2.2k  [RES0603]
U5  ICM-42688-P  [ICM-42688-P]

### Ports
C_Roll_SCL_IMU1_H (bidir), C_Roll_SCL_IMU1_L (bidir), C_Roll_SDA_IMU1_H (bidir), C_Roll_SDA_IMU1_L (bidir)

### Nets
+5V: R26.2 R29.2
GND: C22.2 C23.2 R23.2 U5.2(RESV) U5.3(RESV) U5.6(GND) U5.7(RESV) U5.9(INT2/FSYNC/CLKIN) U5.10(RESV) U5.11(RESV)
VDD: C22.1 C23.1 R20.1 R21.1 R22.1 R24.2 R25.2 R27.2 R28.2 U5.5(VDDIO) U5.8(VDD)
SCL_IMU1: Q4.2(S) R21.2 R27.1 U5.13(AP_SCL/AP_SCLK) ; port C_Roll_SCL_IMU1_L
SDA_IMU1: Q3.2(S) R20.2 R24.1 U5.14(AP_SDA/AP_SDIO/AP_SDI) ; port C_Roll_SDA_IMU1_L
NetP1_45: Q3.3(D) R26.1 ; port C_Roll_SDA_IMU1_H
NetP1_47: Q4.3(D) R29.1 ; port C_Roll_SCL_IMU1_H
NetQ3_1: Q3.1(G) R25.1
NetQ4_1: Q4.1(G) R28.1
NetR22_2: R22.2 U5.12(AP_CS)
NetR23_1: R23.1 U5.1(AP_SDO/AP_AD0)

Not connected (* = marked no-connect by the designer): U5 4(INT1/INT)

### Library data of the parts
C22 = CMP-00691-1: as C1 on sheet Encoder; Packaging: Tape and Reel; Mount: Surface Mount,PCB; Min Operating Temperature: -55°C; Case/Package: 0603; Max Operating Temperature: 125°C; Length: 1.6mm; Voltage Rating: 50V; Width: 0.031inch; Voltage Rating (DC): 50V; Dielectric: X7R; Thickness: 0.034inch; Case Code (Imperial): 0603; Case Code (Metric): 1608; Contact Plating: Tin,Matte; Depth: 0.8mm; Height: 0.8mm; Lead Pitch: 0.7mm; Manufacturer Part Number 1: C0603C104M5RACTU; Package Quantity: 1; Radiation Hardening: No; REACH SVHC: No SVHC; Termination: SMD/SMT
C23 = 885012107014: as C3 on sheet Encoder; Manufacturer Part Number: CL21A476MQYNNNE; RoHS: Yes; Category: Ceramic Capacitors; Stock 1: 3580; Pricing 1: 1=0.37000, 5=0.35200, 10=0.33000, 25=0.31900, 50=0.30900, 100=0.29800 (USD); Mount: Surface Mount; Case/Package: 0805; Case Code (Metric): 2012; Case Code (Imperial): 0805; Min Operating Temperature: -55°C; Max Operating Temperature: 85°C; Packaging: Cut Tape; Voltage Rating: 6.3V; Dielectric: X5R; Voltage Rating (DC): 6.3V; Series: WCAP-CSGP; Length: 0.079inch; Width: 0.049inch; Thickness: 0.057inch; RoHS Compliant: Yes; ComponentLink1URL: http://www.farnell.com/datasheets/1958454.pdf?src-supplier=Farnell; ComponentLink1Description: http://www.farnell.com/datasheets/1958454.pdf?src-supplier=Farnell; ComponentLink2URL: http://www.farnell.com/datasheets/1958454.pdf?src-supplier=Element14; ComponentLink2Description: http://www.farnell.com/datasheets/1958454.pdf?src-supplier=Element14; ComponentLink3URL: https://katalog.we-online.de/pbs/datasheet/885012107014.pdf?src-supplier=Digi-Key; ComponentLink3Description: https://katalog.we-online.de/pbs/datasheet/885012107014.pdf?src-supplier=Digi-Key; ComponentLink4URL: http://www.farnell.com/datasheets/1958454.pdf?src-supplier=Newark; ComponentLink4Description: http://www.farnell.com/datasheets/1958454.pdf?src-supplier=Newark; Supplier 1: Newark
Q3 Q4 = BSS138: N-Channel 50 V 220mA (Ta) 350mW (Ta) Surface Mount SOT-23-3; MF: onsemi; SnapEDA_Link: https://www.snapeda.com/parts/BSS138/Onsemi/view-part/?ref=snap; Package: SOT-23-3 Motorola; Value: *; MP: BSS138; Check_prices: https://www.snapeda.com/parts/BSS138/Onsemi/view-part/?ref=eda
R20 R21 = CMP-01404-1: RES SMD 2.2K OHM 1% 1/10W 0603; Manufacturer 1: Yageo; Voltage Rating (DC): 50V; Resistance Tolerance: 5%; Temperature Coefficient: 100ppm/°C; Max Power Dissipation: 100mW; Number of Terminations: 2; Width: 0.8mm; Min Operating Temperature: -55°C; Case/Package: 0603; Military Standard: Not; Termination: SMD/SMT; Manufacturer Part Number 1: RC0603FR-072K2L; Construction: Rectangular; Features: Moisture Resistant; Length: 1.6mm; Lead Free: Lead Free; REACH SVHC: No SVHC; Voltage Rating: 50V; Case Code (Metric): 1608; Case Code (Imperial): 0603; Packaging: Tape and Reel; Max Operating Temperature: 155°C; Size Code: 0603; Resistor Type: Thick Film; Tolerance: 5%; Number of Pins: 2; Depth: 0.8mm; Power Rating: 100mW; Series: RC
R22 = CMP-00067-1: RES SMD 1K OHM 1% 1/10W 0603; Manufacturer: Yageo; Voltage Rating: 50V; Power Rating: 100mW; Temperature Coefficient: 100ppm/°C; Packaging: Tape and Reel; Min Operating Temperature: -55°C; Radiation Hardening: No; Case Code (Metric): 1608; Height: 0.45mm; Max Operating Temperature: 155°C; Composition: Thick Film; Depth: 0.8mm; Military Standard: Not; Termination: SMD/SMT; Tolerance: 1%; Lead Free: Lead Free; Length: 1.6mm; Contact Plating: Tin,Matte; Case Code (Imperial): 0603; REACH SVHC: No SVHC; Manufacturer Part Number: RC0603FR-071KL; Case/Package: 0603; Manufacturer 1: Yageo; Manufacturer Part Number 1: RC0603FR-071KL
R23 = CMP-01404-1: as R11 on sheet Driver; Number of Terminations: 2; Width: 0.8mm; Min Operating Temperature: -55°C; Case/Package: 0603; Military Standard: Not; Termination: SMD/SMT; Manufacturer Part Number 1: RC0603JR-074K7L; Construction: Rectangular; Features: Moisture Resistant; Length: 1.6mm; Resistance Tolerance: 5%; Lead Free: Lead Free; REACH SVHC: No SVHC; Voltage Rating: 50V; Case Code (Metric): 1608; Case Code (Imperial): 0603; Packaging: Tape and Reel; Max Operating Temperature: 155°C; Size Code: 0603; Resistor Type: Thick Film; Tolerance: 5%; Number of Pins: 2; Depth: 0.8mm; Power Rating: 100mW; Series: RC
R24 R26 R27 R29 = RC0603FR-072K2L: as R5 on sheet Encoder; Supplier 1: Avnet; Manufacturer Part Number: RC0603FR-072K2L; RoHS: Compliant; Category: Chip SMD Resistors; Stock 1: 415000; Pricing 1: 5000=0.00146, 10000=0.00141, 20000=0.00136, 30000=0.00131, 40000=0.00127 (USD); Case/Package: 0603; Case Code (Imperial): 0603; Case Code (Metric): 0603; China RoHS: Non-Compliant; Composition: Thick Film; Depth: 800µm; Features: Moisture Resistant; Height: 450µm; Lead Free: Lead Free; Length: 1.6mm; Lifecycle Status: Production; Max Operating Temperature: 155°C; Military Standard: Not; Min Operating Temperature: -55°C; Mount: Surface Mount; Number of Pins: 2; Number of Terminals: 2; Number of Terminations: 2; Packaging: Tape & Reel; Power Dissipation: 100mW; Power Rating: 100mW; REACH SVHC: Yes; Schedule B: 8533210045, 8533210045|8533210045|8533210045|8533210045|8533210045|8533210045|8533210045|8533210045|8533210045|8533210045|8533210045|8533210045|8533210045|8533210045|8533210045, 8533210045|8533210045|8533210045|8533210045|8533210045|8533210045|8533210045|8533210045|8533210045|8533210045|8533210045|8533210045|8533210045|8533210045|8533210045|8533210045, 8533210045|8533210045|8533210045|8533210045|8533210045|8533210045|8533210045|8533210045|8533210045|8533210045|8533210045|8533210045|8533210045|8533210045|8533210045|8533210045|8533210045; Termination: SMD/SMT; Tolerance: 1%; Width: 800µm; Working Voltage: 75V; ComponentLink1URL: https://datasheet.octopart.com:443/RC0603FR-072K2L-Yageo-datasheet-175887523.pdf?src-supplier=IHS; ComponentLink1Description: https://datasheet.octopart.com:443/RC0603FR-072K2L-Yageo-datasheet-175887523.pdf?src-supplier=IHS; ComponentLink2URL: https://datasheet.octopart.com:443/RC0603FR-072K2L-Yageo-datasheet-103092701.pdf?src-supplier=Upverter; ComponentLink2Description: https://datasheet.octopart.com:443/RC0603FR-072K2L-Yageo-datasheet-103092701.pdf?src-supplier=Upverter; ComponentLink3URL: https://datasheet.octopart.com:443/RC0603FR-072K2L-Yageo-datasheet-8328172.pdf?src-supplier=Newark; ComponentLink3Description: https://datasheet.octopart.com:443/RC0603FR-072K2L-Yageo-datasheet-8328172.pdf?src-supplier=Newark; ComponentLink4URL: https://datasheet.octopart.com:443/RC0603FR-072K2L-Yageo-datasheet-12596169.pdf?src-supplier=Newark; ComponentLink4Description: https://datasheet.octopart.com:443/RC0603FR-072K2L-Yageo-datasheet-12596169.pdf?src-supplier=Newark; ComponentLink5URL: https://datasheet.octopart.com:443/RC0603FR-072K2L-Yageo-datasheet-13691069.pdf?src-supplier=Newark; ComponentLink5Description: https://datasheet.octopart.com:443/RC0603FR-072K2L-Yageo-datasheet-13691069.pdf?src-supplier=Newark; ComponentLink6URL: https://datasheet.octopart.com:443/RC0603FR-072K2L-Yageo-datasheet-34211833.pdf?src-supplier=element14+APAC; ComponentLink6Description: https://datasheet.octopart.com:443/RC0603FR-072K2L-Yageo-datasheet-34211833.pdf?src-supplier=element14+APAC; ComponentLink7URL: https://datasheet.octopart.com:443/RC0603FR-072K2L-Yageo-datasheet-62067350.pdf?src-supplier=element14+APAC; ComponentLink7Description: https://datasheet.octopart.com:443/RC0603FR-072K2L-Yageo-datasheet-62067350.pdf?src-supplier=element14+APAC; ComponentLink8URL: https://datasheet.octopart.com:443/RC0603FR-072K2L-Yageo-datasheet-17842380.pdf?src-supplier=element14+APAC; ComponentLink8Description: https://datasheet.octopart.com:443/RC0603FR-072K2L-Yageo-datasheet-17842380.pdf?src-supplier=element14+APAC; ComponentLink9URL: https://datasheet.octopart.com:443/RC0603FR-072K2L-Yageo-datasheet-21426514.pdf?src-supplier=element14+APAC; ComponentLink9Description: https://datasheet.octopart.com:443/RC0603FR-072K2L-Yageo-datasheet-21426514.pdf?src-supplier=element14+APAC; ComponentLink10URL: https://datasheet.octopart.com:443/RC0603FR-072K2L-Yageo-datasheet-164759695.pdf?src-supplier=Future+Electronics; ComponentLink10Description: https://datasheet.octopart.com:443/RC0603FR-072K2L-Yageo-datasheet-164759695.pdf?src-supplier=Future+Electronics; ComponentLink11URL: https://datasheet.octopart.com:443/RC0603FR-072K2L-Yageo-datasheet-137700087.pdf?src-supplier=Future+Electronics; ComponentLink11Description: https://datasheet.octopart.com:443/RC0603FR-072K2L-Yageo-datasheet-137700087.pdf?src-supplier=Future+Electronics; ComponentLink12URL: https://datasheet.octopart.com:443/RC0603FR-072K2L-Yageo-datasheet-27584510.pdf?src-supplier=Future+Electronics; ComponentLink12Description: https://datasheet.octopart.com:443/RC0603FR-072K2L-Yageo-datasheet-27584510.pdf?src-supplier=Future+Electronics; ComponentLink13URL: https://datasheet.octopart.com:443/RC0603FR-072K2L-Yageo-datasheet-15599030.pdf?src-supplier=Future+Electronics; ComponentLink13Description: https://datasheet.octopart.com:443/RC0603FR-072K2L-Yageo-datasheet-15599030.pdf?src-supplier=Future+Electronics; ComponentLink14URL: https://datasheet.octopart.com:443/RC0603FR-072K2L-Yageo-datasheet-8324193.pdf?src-supplier=Future+Electronics; ComponentLink14Description: https://datasheet.octopart.com:443/RC0603FR-072K2L-Yageo-datasheet-8324193.pdf?src-supplier=Future+Electronics; ComponentLink15URL: https://datasheet.octopart.com:443/RC0603FR-072K2L-Yageo-datasheet-79472498.pdf?src-supplier=Megastar; ComponentLink15Description: https://datasheet.octopart.com:443/RC0603FR-072K2L-Yageo-datasheet-79472498.pdf?src-supplier=Megastar; ComponentLink16URL: https://datasheet.octopart.com/RC0603FR-072K2L-Yageo-datasheet-73766026.pdf; ComponentLink16Description: https://datasheet.octopart.com/RC0603FR-072K2L-Yageo-datasheet-73766026.pdf; ComponentLink17URL: https://datasheet.octopart.com:443/RC0603FR-072K2L-Yageo-datasheet-118562.pdf?src-supplier=DigiKey; ComponentLink17Description: https://datasheet.octopart.com:443/RC0603FR-072K2L-Yageo-datasheet-118562.pdf?src-supplier=DigiKey; ComponentLink18URL: https://datasheet.octopart.com:443/RC0603FR-072K2L-Yageo-datasheet-499455.pdf?src-supplier=element14; ComponentLink18Description: https://datasheet.octopart.com:443/RC0603FR-072K2L-Yageo-datasheet-499455.pdf?src-supplier=element14; ComponentLink19URL: http://sigma.octopart.com:80/rohs_statement/Yageo-company-2.pdf?src-supplier=Compliance+Statements; ComponentLink19Description: http://sigma.octopart.com:80/rohs_statement/Yageo-company-2.pdf?src-supplier=Compliance+Statements; ComponentLink20URL: http://sigma.octopart.com:80/conflict_mineral_statement/Yageo-company-3.pdf?src-supplier=Compliance+Statements; ComponentLink20Description: http://sigma.octopart.com:80/conflict_mineral_statement/Yageo-company-3.pdf?src-supplier=Compliance+Statements; Supplier Part Number 1: RC0603FR-072K2L
R25 R28 = CMP-01078-4: RES SMD 10 OHM 5% 1/10W 0603; Manufacturer 1: Rohm Semiconductor; Voltage Rating (DC): 50V; Power Rating: 100mW; Temperature Coefficient: 200ppm/°C; Manufacturer Part Number 1: MCR03EZPJ100; Tolerance: 5%; Contact Plating: Tin; Mount: Surface Mount; Max Operating Temperature: 155°C; Lead Free: Lead Free; Min Operating Temperature: -55°C; Case/Package: 0603; Composition: Thick Film
U5 = ICM-42688-P: Accelerometer, Gyroscope, 6 Axis Sensor Output; Package: None; MP: ICM-42688-P; Value: *; Availability: Unavailable; Price: None

## Nets that join several sheets
12V: Driver (7 pins), PWR (5 pins)
+5V: Encoder (C1.1 R7.2 R10.2 U1.11), PWR (8 pins), IMU (R26.2 R29.2)
GND: Encoder (10 pins), Driver (15 pins), PWR (16 pins), Connector (13 pins), IMU (10 pins)
VDD: PWR (6 pins), IMU (11 pins)
NetP1_20: Driver (R11.1 U2.22 U2.24 U2.26), Connector (P1.20)
NetP1_24: Driver (U2.27), Connector (P1.24)
NetP1_26: Driver (U2.25), Connector (P1.26)
NetP1_28: Driver (U2.23), Connector (P1.28)
NetP1_45: Connector (P1.45), IMU (Q3.3 R26.1)
NetP1_47: Connector (P1.47), IMU (Q4.3 R29.1)
NetP1_49: Encoder (Q1.3 R7.1), Connector (P1.49)
NetP1_51: Encoder (Q2.3 R10.1), Connector (P1.51)